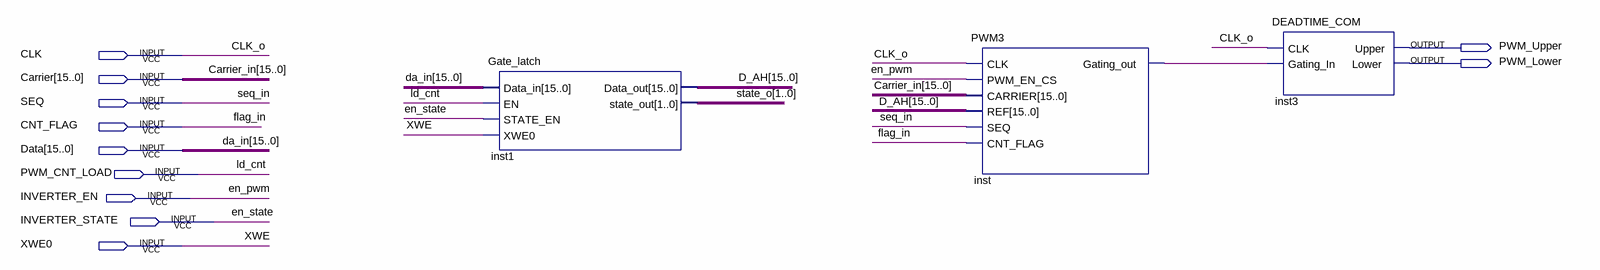
[diagram p0: schematic sheet]
// Quartus schematic INVERTER.bdf as structural Verilog: 3 symbols, 11 pins
module INVERTER (
  input  CLK,
  input  [15:0] Carrier,
  input  SEQ,
  input  CNT_FLAG,
  input  [15:0] Data,
  input  PWM_CNT_LOAD,
  input  INVERTER_EN,
  input  INVERTER_STATE,
  input  XWE0,
  output PWM_Upper,
  output PWM_Lower
);

  wire inst_gating_out;
  wire [1:0] state_o;
  wire [15:0] D_AH;

  Gate_latch inst1 (
    .Data_in(Data), .EN(PWM_CNT_LOAD), .STATE_EN(INVERTER_STATE), .XWE0(XWE0), .Data_out(D_AH),
    .state_out(state_o));
  PWM3 inst (
    .CLK(CLK), .PWM_EN_CS(INVERTER_EN), .CARRIER(Carrier), .REF(D_AH), .SEQ(SEQ), .CNT_FLAG(CNT_FLAG),
    .Gating_out(inst_gating_out));
  DEADTIME_COM inst3 (.CLK(CLK), .Gating_In(inst_gating_out), .Upper(PWM_Upper), .Lower(PWM_Lower));

  // Other names for the same wires on the sheet: Carrier_in[15:0] = Carrier; CLK_o = CLK; da_in[15:0] = Data;
  //   en_pwm = INVERTER_EN; en_state = INVERTER_STATE; flag_in = CNT_FLAG; ld_cnt = PWM_CNT_LOAD; seq_in = SEQ;
  //   XWE = XWE0
endmodule
